# Altium schematic sheet Header-Male-2.54_1x2.schdoc
size 39 x 32 mm
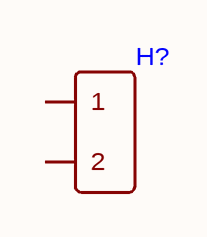
[diagram p0: Header-Male-2.54_1x2.schdoc]

## Parts
H?  (no value)  [HDR-TH_2P-P2.54-V-M-1]

## Nets

Not connected (* = marked no-connect by the designer): H? 1 2

## Library data of the parts
H? = Header-Male-2.54_1x2